# EasyEDA Pro project 四轮车板子.epro, board PCB6
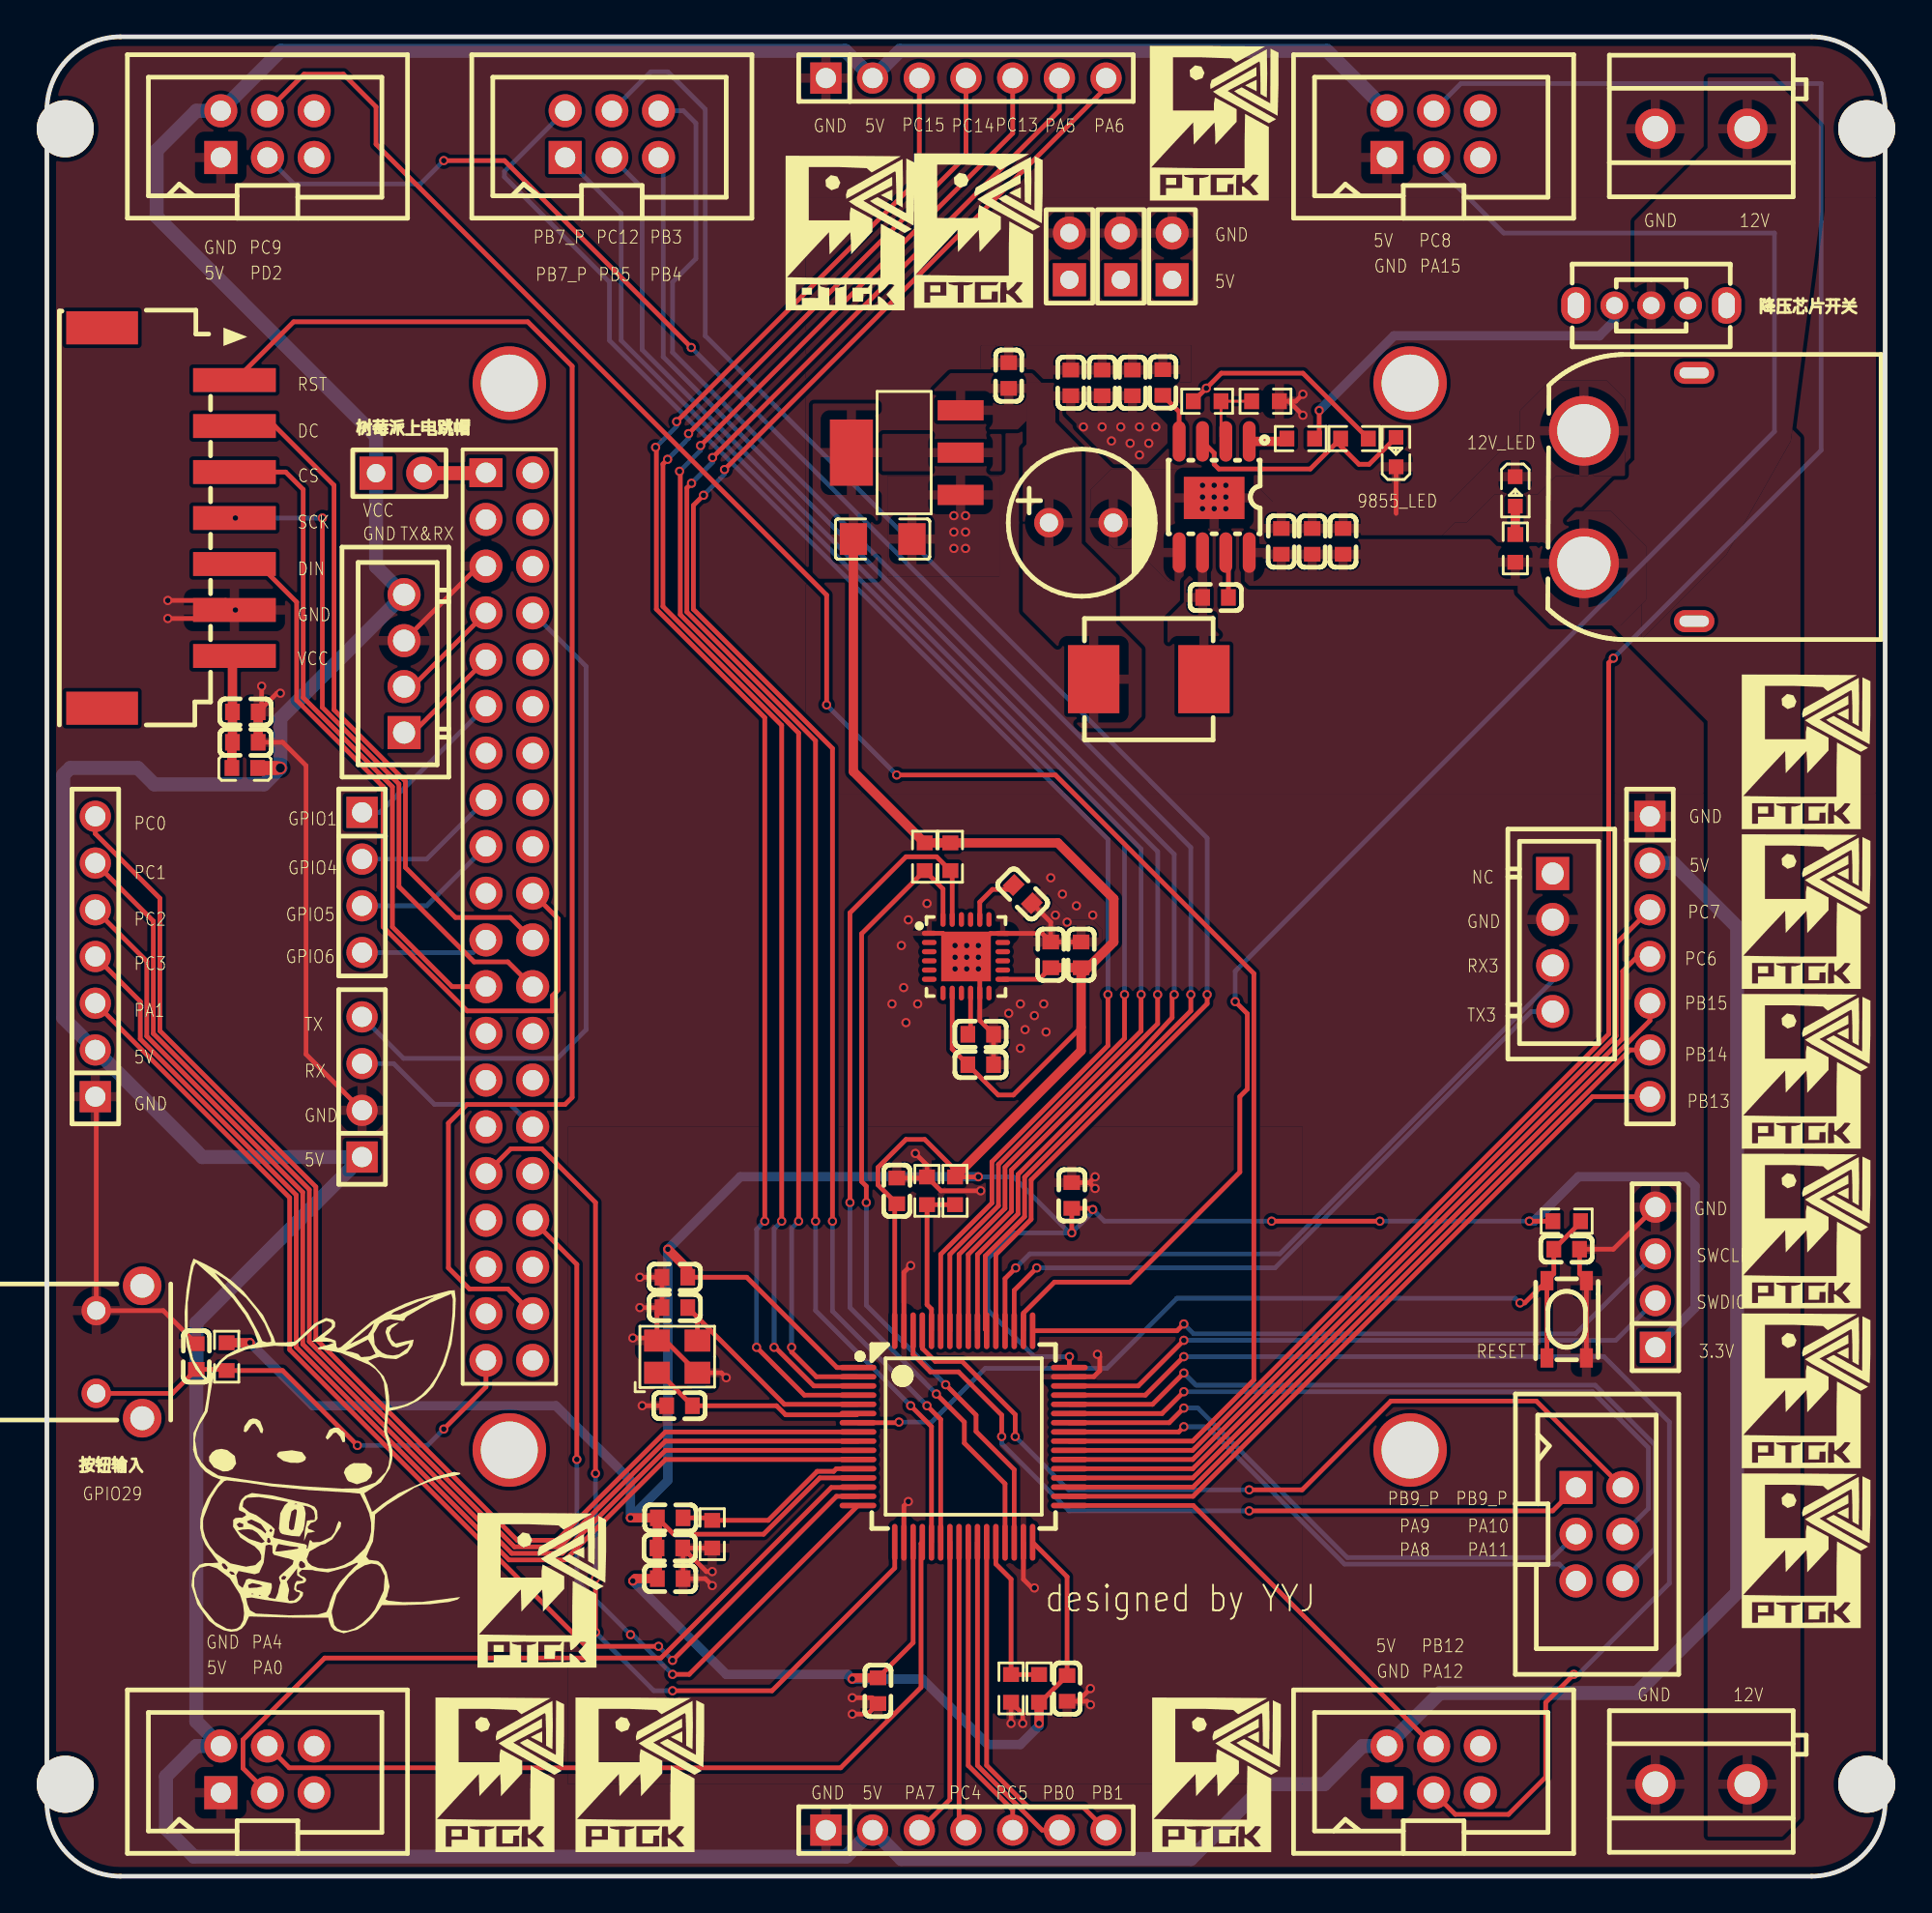
[diagram p12: board, top side]
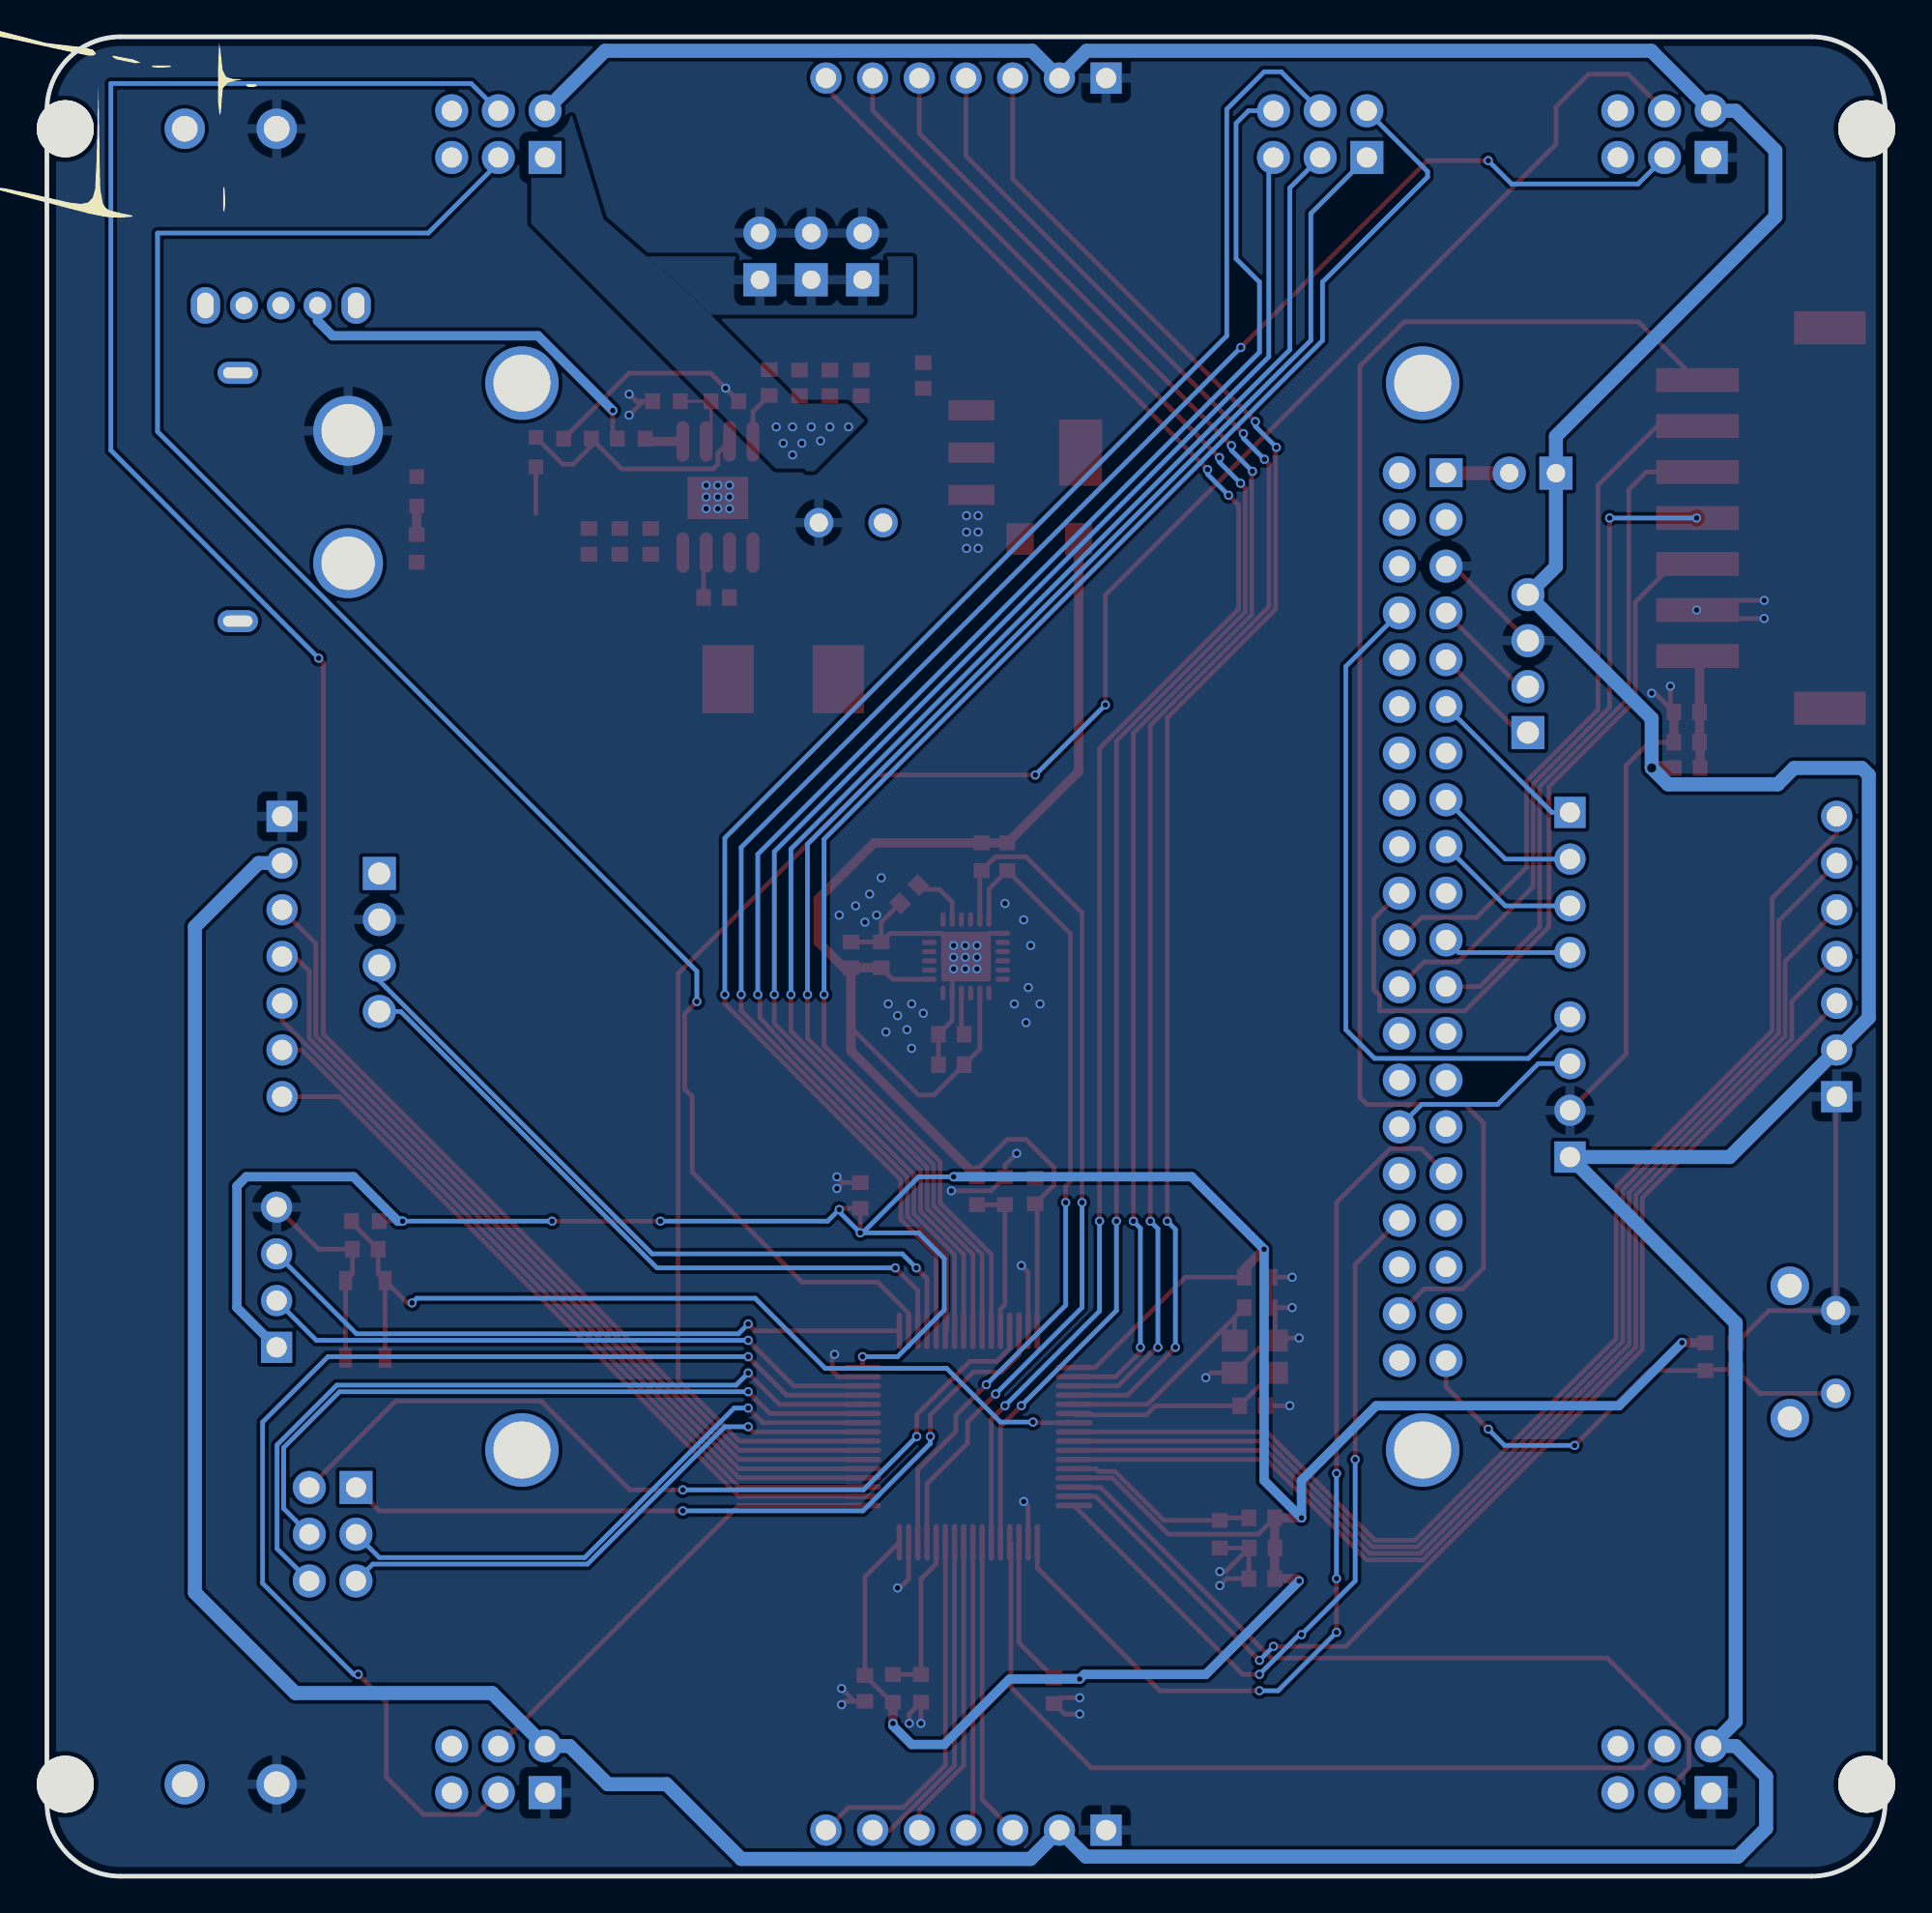
[diagram p13: board, bottom side, seen from below]

Outline 100 x 100 mm; copper layers: Top Layer, Bottom Layer. Coordinates in mm from the lower left corner of the outline.
Outline path: 0,96 0,4 arc(1.17,1.17) 4,0 96,0 arc(98.83,1.17) 100,4 100,96 arc(98.83,98.83) 96,100 4,100 arc(1.17,98.83) 0,96
Stack: Top Layer 0.035mm / Dielectric1 1.51mm FR4 er 4.5 / Bottom Layer 0.035mm

## Design rules (mm)
template: 自定义配置
spacing copperThickness1oz (default): track to track 0.102, other pairs 0.152 to 0.3
spacing copperThickness2oz: track to track 0.203, other pairs 0.152 to 0.3
track width copperThickness1oz (default): min 0.127, default 0.254, max 2.54
track width copperThickness2oz: min 0.203, default 0.254, max 2.54
differential pair differentialPair (default): width min 0.127, default 0.254, max 2.54; gap min 0.152, default 0.152
via viaSize (default): diameter min 0.5, default 0.61, max 10; hole min 0.3, default 0.305, max 6.3

## Placement (name value [footprint] x y rotation side)
C7  0.1u  [C0603]  8.13 28.25 270 top
C9  100nF  [C0603]  60.71 81.2 270 top
C10  22uF  [C0603]  67.15 72.57 90 top
C11  22uF  [C0603]  68.83 72.57 90 top
C12  100nF  [C0603]  70.51 72.57 90 top
C13  100nF  [C0603]  63.57 69.52 180 top
C15  22uF  [C0603]  55.7 81.19 270 top
C16  22uF  [C0603]  57.4 81.19 270 top
C17  0.1uF  [C0603]  59.06 81.19 270 top
C18  100nF  [C1206]  45.47 72.69 0 top
C19  100nF  [C0603]  52.32 81.58 90 top
C27  220uF  [CAP-TH_BD8.0-P3.50-D0.6-FD]  56.26 73.58 0 top
C29  100n  [C0603]  10.8 63.3 180 top
C30  10u  [C0603]  10.8 61.65 180 top
C31  100nF  [C0603]  50.8 44.12 0 top
C32  100nF  [C0603]  50.8 45.77 0 top
C33  2.2uF  [C0603]  53.09 53.39 315 top
C34  2.2uF  [C0603]  54.61 50.09 270 top
C35  100nF  [C0603]  56.26 50.09 270 top
C43  0.1u  [C0603]  34.16 32.56 0 top
C44  0.1u  [C0603]  45.21 10.08 90 top
C45  0.1u  [C0603]  55.75 37.01 270 top
C46  0.1u  [C0603]  46.24 37.26 270 top
C47  0.1u  [C0603]  55.5 10.21 90 top
C51  0.1u  [C0603]  82.68 34.09 0 top
C52  10p  [C0603]  34.16 30.91 0 top
C53  10p  [C0603]  34.42 25.58 0 top
C56  0.1u  [C0603]  33.91 19.48 180 top
C57  100nF  [C0603]  33.91 16.18 0 top
C58  10u  [C0603]  33.89 17.85 0 top
CN1  X8821WRS-07-9TSN  [CONN-SMD_X8821WRS-07-9TSN]  6.6 73.84 270 top
CN2  XT60PW-M  [CONN-TH_XT60PW-M]  86.61 74.98 180 top
CN3  XH-4A  [CONN-TH_4P-P2.50_XH-4A]  19.43 65.92 90 top
CN4  BH254V-6P  [IDC-TH_6P-P2.54-V-R2-C3-S2.54]  12 94.71 0 top
CN5  BH254V-6P  [IDC-TH_6P-P2.54-V-R2-C3-S2.54]  12 5.81 0 top
CN6  BH254V-6P  [IDC-TH_6P-P2.54-V-R2-C3-S2.54]  75.44 94.71 0 top
CN7  BH254V-6P  [IDC-TH_6P-P2.54-V-R2-C3-S2.54]  75.44 5.81 0 top
CN8  XH-4A  [CONN-TH_4P-P2.50_XH-4A]  81.91 50.76 270 top
CN9  BH254V-6P  [IDC-TH_6P-P2.54-V-R2-C3-S2.54]  30.73 94.71 0 top
CN10  BH254V-6P  [IDC-TH_6P-P2.54-V-R2-C3-S2.54]  84.46 18.59 270 top
H1  -  [HDR-TH_2P-P2.54-V-M-1]  55.63 88.06 90 top
H2  -  [HDR-TH_2P-P2.54-V-M-1]  58.42 88.06 90 top
H3  -  [HDR-TH_2P-P2.54-V-M-1]  61.21 88.06 90 top
H7  2.54mm2*20P直排针  [HDR-TH_40P-P2.54-V-M-R2-C20-S2.54]  25.16 52.17 270 top
H24  -  [HDR-TH_7P-P2.54-V-M]  50 97.76 0 top
H25  -  [HDR-TH_7P-P2.54-V-M]  2.64 50 90 top
H26  -  [HDR-TH_7P-P2.54-V-M]  87.21 50 270 top
H27  -  [HDR-TH_7P-P2.54-V-M]  50 2.51 0 top
H28  -  [HDR-TH_2P-P2.54-V-M-1]  19.18 76.28 0 top
H29  -  [HDR-TH_4P-P2.54-V-M]  87.5 32.56 90 top
H30  -  [HDR-TH_4P-P2.54-V-M]  17.14 54.03 270 top
L1  3.3uH  [IND-SMD_L7.0-W6.6]  59.94 65.08 180 top
L4  600Ω  [L0603]  10.77 60.25 180 top
LED1  -  [LED_0603]  73.39 77.47 90 top
LED4  -  [LED_0603]  79.89 75.23 270 top
NOREF  -  [Pad_e8]  74.16 23.17 270 top
NOREF#2  -  [Pad_e5]  25.16 81.17 270 top
NOREF#3  -  [Pad_e6]  74.16 81.17 180 top
NOREF#4  -  [Pad_e246]  99 95 0 top
NOREF#5  -  [Pad_e243]  1 95 0 top
NOREF#6  -  [Pad_e245]  99 5 0 top
NOREF#7  -  [Pad_e7]  25.16 23.17 90 top
NOREF#8  -  [Pad_e244]  1 5 0 top
R7  100K  [R0603]  68.21 78.16 180 top
R8  118K  [R0603]  63.12 80.19 180 top
R9  20.5K  [R0603]  66.29 80.19 180 top
R10  4.7K  [R0603]  71.13 78.16 180 top
R11  4.7K  [R0603]  49.15 55.42 90 top
R12  0  [R0603]  36.19 18.59 270 top
R22  10k  [R0603]  9.78 28.25 90 top
R23  4.7K  [R0603]  47.75 55.42 90 top
R24  10K  [R0603]  79.88 72.19 90 top
R52  10k  [R0603]  82.68 35.61 0 top
R57  NC  [R0603]  49.4 37.26 90 top
R58  NC  [R0603]  53.97 10.21 270 top
R59  10k  [R0603]  47.88 37.26 270 top
R60  10k  [R0603]  52.45 10.21 90 top
SW9  KAN0637-0701B  [SW-TH_KAN0637-0701B]  3.94 28.5 270 top
SW11  SS12D07L3B  [SW-TH_SS-12D07-X-X]  87.28 85.39 180 top
SW12  -  [SW-SMD_4P-L4.2-W3.4-P2.15-LS4.5-TL]  82.68 30.28 270 top
U3  STM32F103RCT6  [LQFP-64_L10.0-W10.0-P0.50-LS12.0-BL]  49.87 23.9 270 top
U5  FR9855SP  [SOIC-8_L4.9-W3.9-P1.27-LS6.0-BL-EP3.3]  63.5 74.98 180 top
U6  -  [SOT-223-3_L6.5-W3.4-P2.30-LS7.0-BR]  46.74 77.39 0 top
U10  MPU-6050  [QFN-24_L4.0-W4.0-P0.50-BL-EP2.7]  50 50.01 270 top
U12  KF301-5.0-2P  [CONN-TH_P5.00_KF301-5.0-2P]  90 95 0 top
U14  KF301-5.0-2P  [CONN-TH_P5.00_KF301-5.0-2P]  90 5 0 top
UART1  -  [HDR-TH_4P-P2.54-V-F]  17.14 42.91 90 top
X2  8MHz  [OSC-SMD_4P-L3.2-W2.5-BL]  34.29 28.25 0 top

## Footprints (pads in the part's own frame, mm; a bottom-side part is the same pattern mirrored in y, then rotated)
C0603
  rect 0.8x0.9 smd: 1(-0.7,0) 2(0.7,0)
C1206
  rect 1.485x1.728 smd: 1(-1.593,0) 2(1.593,0)
CAP-TH_BD8.0-P3.50-D0.6-FD
  round 1.6 hole 1: 1(-1.75,0) 2(1.75,0)
CONN-SMD_X8821WRS-07-9TSN
  rect 1.3x4.5 smd: 1(-7.5,3.6) 2(-5,3.6) 3(-2.5,3.6) 4(0,3.6) 5(2.5,3.6) 6(5,3.6) 7(7.5,3.6)
  rect 1.8x3.9 smd: 8(10.34,-3.6) 9(-10.34,-3.6)
CONN-TH_4P-P2.50_XH-4A
  rect 1.8x1.8 hole 1.199: 1(-3.751,0)
  round 1.8 hole 1.199: 2(-1.25,0) 3(1.25,0) 4(3.751,0)
CONN-TH_P5.00_KF301-5.0-2P
  round 2.2 hole 1.4: 1(-2.5,0) 2(2.5,0)
CONN-TH_XT60PW-M
  round 3.8 hole 2.9: 1(3,-3.6) 2(3,3.6)
  oval 2.2x1.2 hole 1.6x0.6: 3(-3,6.75) 4(-3,-6.75)
HDR-TH_2P-P2.54-V-M-1
  rect 1.8x1.8 hole 1: 1(-1.27,0)
  round 1.8 hole 1: 2(1.27,0)
HDR-TH_4P-P2.54-V-F
  rect 1.7x1.7 hole 1.1: 1(-3.81,0)
  round 1.7 hole 1.1: 2(-1.27,0) 3(1.27,0) 4(3.81,0)
HDR-TH_4P-P2.54-V-M
  rect 1.7x1.7 hole 1.1: 1(-3.81,0)
  round 1.7 hole 1.1: 2(-1.27,0) 3(1.27,0) 4(3.81,0)
HDR-TH_7P-P2.54-V-M
  rect 1.7x1.7 hole 1.1: 1(-7.62,0)
  round 1.7 hole 1.1: 2(-5.08,0) 3(-2.54,0) 4(0,0) 5(2.54,0) 6(5.08,0) 7(7.62,0)
HDR-TH_40P-P2.54-V-M-R2-C20-S2.54
  rect 1.575x1.8 hole 1.1: 1(-24.13,-1.27)
  round 1.8 hole 1.1: 2(-24.13,1.27) 3(-21.59,-1.27) 4(-21.59,1.27) 5(-19.05,-1.27) 6(-19.05,1.27) 7(-16.51,-1.27) 8(-16.51,1.27) 9(-13.97,-1.27) 10(-13.97,1.27) 11(-11.43,-1.27) 12(-11.43,1.27) 13(-8.89,-1.27) 14(-8.89,1.27) 15(-6.35,-1.27) 16(-6.35,1.27) 17(-3.81,-1.27) 18(-3.81,1.27) 19(-1.27,-1.27) 20(-1.27,1.27) 21(1.27,-1.27) 22(1.27,1.27) 23(3.81,-1.27) 24(3.81,1.27) 25(6.35,-1.27) 26(6.35,1.27) 27(8.89,-1.27) 28(8.89,1.27) 29(11.43,-1.27) 30(11.43,1.27) 31(13.97,-1.27) 32(13.97,1.27) 33(16.51,-1.27) 34(16.51,1.27) 35(19.05,-1.27) 36(19.05,1.27) 37(21.59,-1.27) 38(21.59,1.27) 39(24.13,-1.27) 40(24.13,1.27)
IDC-TH_6P-P2.54-V-R2-C3-S2.54
  rect 1.8x1.8 hole 1.1: 1(-2.54,-1.27)
  round 1.8 hole 1.1: 2(-2.54,1.27) 3(0,-1.27) 4(0,1.27) 5(2.54,-1.27) 6(2.54,1.27)
IND-SMD_L7.0-W6.6
  rect 2.799x3.701 smd: 1(-2.999,0) 2(2.999,0)
L0603
  rect 0.8x0.864 smd: 1(-0.7,0) 2(0.7,0)
LED_0603
  rect 0.8x0.8 smd: 1(-0.851,-0.01) 2(0.75,-0.005)
LQFP-64_L10.0-W10.0-P0.50-LS12.0-BL
  oval 0.3x2 smd: 1(-3.75,-5.75) 2(-3.249,-5.75) 3(-2.75,-5.75) 4(-2.249,-5.75) 5(-1.75,-5.75) 6(-1.25,-5.75) 7(-0.75,-5.75) 8(-0.249,-5.75) 9(0.25,-5.75) 10(0.75,-5.75) 11(1.25,-5.75) 12(1.75,-5.75) 13(2.25,-5.75) 14(2.751,-5.75) 15(3.25,-5.75) 16(3.751,-5.75) 33(3.751,5.75) 34(3.25,5.75) 35(2.751,5.75) 36(2.25,5.75) 37(1.75,5.75) 38(1.25,5.75) 39(0.75,5.75) 40(0.25,5.75) 41(-0.249,5.75) 42(-0.75,5.75) 43(-1.25,5.75) 44(-1.75,5.75) 45(-2.249,5.75) 46(-2.75,5.75) 47(-3.249,5.75) 48(-3.75,5.75)
  oval 2x0.3 smd: 17(5.75,-3.75) 18(5.75,-3.25) 19(5.75,-2.75) 20(5.75,-2.25) 21(5.75,-1.75) 22(5.75,-1.25) 23(5.75,-0.75) 24(5.75,-0.25) 25(5.75,0.25) 26(5.75,0.75) 27(5.75,1.25) 28(5.75,1.75) 29(5.75,2.25) 30(5.75,2.75) 31(5.75,3.25) 32(5.75,3.75) 49(-5.75,3.75) 50(-5.75,3.25) 51(-5.75,2.75) 52(-5.75,2.25) 53(-5.75,1.75) 54(-5.75,1.25) 55(-5.75,0.75) 56(-5.75,0.25) 57(-5.75,-0.25) 58(-5.75,-0.75) 59(-5.75,-1.25) 60(-5.75,-1.75) 61(-5.75,-2.25) 62(-5.75,-2.75) 63(-5.75,-3.25) 64(-5.75,-3.75)
OSC-SMD_4P-L3.2-W2.5-BL
  rect 1.4x1.2 smd: 1(-1.1,-0.875) 2(1.1,-0.875) 3(1.1,0.875) 4(-1.1,0.875)
Pad_e5
  round 4 hole 3.1: 1(0,0)
Pad_e6
  round 4 hole 3.1: 1(0,0)
Pad_e7
  round 4 hole 3.1: 1(0,0)
Pad_e8
  round 4 hole 3.1: 1(0,0)
Pad_e243
  round 3.1 hole 3.1: 1(0,0)
Pad_e244
  round 3.1 hole 3.1: 1(0,0)
Pad_e245
  round 3.1 hole 3.1: 1(0,0)
Pad_e246
  round 3.1 hole 3.1: 1(0,0)
QFN-24_L4.0-W4.0-P0.50-BL-EP2.7
  oval 0.28x0.8 smd: 1(-1.25,-2) 2(-0.75,-2) 3(-0.25,-2) 4(0.25,-2) 5(0.75,-2) 6(1.25,-2) 13(1.25,2) 14(0.75,2) 15(0.25,2) 16(-0.25,2) 17(-0.75,2) 18(-1.242,2)
  oval 0.8x0.28 smd: 7(2,-1.25) 8(2,-0.75) 9(2,-0.25) 10(2,0.25) 11(2,0.75) 12(2,1.25) 19(-2,1.25) 20(-2,0.75) 21(-2,0.25) 22(-2,-0.25) 23(-2,-0.75) 24(-2,-1.25)
  rect 2.7x2.7 smd: 25(0.013,0)
R0603
  rect 0.806x0.864 smd: 1(-0.753,0) 2(0.753,0)
SOIC-8_L4.9-W3.9-P1.27-LS6.0-BL-EP3.3
  oval 0.7x2.2 smd: 1(-1.905,-3.022) 2(-0.635,-3.022) 3(0.635,-3.022) 4(1.905,-3.022) 5(1.905,3.022) 6(0.635,3.022) 7(-0.635,3.022) 8(-1.905,3.022)
  rect 3.3x2.3 smd: 9(0,0.051)
SOT-223-3_L6.5-W3.4-P2.30-LS7.0-BR
  rect 2.5x1.1 smd: 1(2.97,-2.3) 2(2.97,0) 3(2.97,2.3)
  rect 2.34x3.6 smd: 4(-2.97,0)
SW-SMD_4P-L4.2-W3.4-P2.15-LS4.5-TL
  rect 1.049x0.701 smd: 1(-2.1,1.075) 2(2.1,1.075) 3(-2.1,-1.075) 4(2.1,-1.075)
SW-TH_KAN0637-0701B
  round 1.6 hole 1: 1(-2.25,-1.25) 2(2.25,-1.25)
  round 2.1 hole 1.3: 3(-3.6,1.25) 4(3.6,1.25)
SW-TH_SS-12D07-X-X
  round 1.524 hole 0.914: 1(-2,0) 2(0,0) 3(2,0)
  oval 1.6x2 hole 0.9x1.4: EH(-4.1,0) EH(4.1,0)

## Nets
As in the schematic.

Pads without a net: CN1 8 9; CN2 3 4; CN4 5 6; CN5 5 6; CN6 5 6; CN7 5 6; CN8 1; H7 2 3 4 6 10 12 13 14 16 18 19 25 26 27 28 29 32 33 35 36 37 40; NOREF 1; NOREF#2 1; NOREF#3 1; NOREF#4 1; NOREF#5 1; NOREF#6 1; NOREF#7 1; NOREF#8 1; SW9 3 4; SW11 1 EH; U10 2 3 4 5 6 7 9 12 14 15 16 17 19 21 22

## Via types
v1: diameter 0.5, hole 0.3, Top Layer to Bottom Layer, 162 vias
v2: diameter 0.7, hole 0.5, Top Layer to Bottom Layer, 1 via

## Routing (per net, layer and track width the routed paths; a pad name or vN(x,y) marks a point on that pad's centre or on a via; arc(x,y) is an arc through that point)
AGND: length 10.7
  Top Layer w0.254: U3.12 42.95,22.15 42.8,22.01 41.9,22.01 39.24,19.35 R12.1 36.06,19.48 C56.1
GND: length 139.7
  Top Layer w0.254: 46.24,37.96 47.82,37.96 R59.1 ; 56.7,37.71 56.71,37.71 v1(57.02,38.02) ; 56.7,37.71 v1(57.02,37.39) ; 56.7,37.71 C45.1 ; v1(46.99,33.2) 46.62,32.83 U3.63 ; v1(47.24,39.29) 47.88,38.66 R59.1 ; C52.1 33.19,30.64 X2.4 ; C52.1 v1(32.26,30.91) ; C52.1 C43.1 v1(32.26,32.56) ; v1(12.7,64.31) 12.51,64.31 11.68,63.49 ; U3.47 56.95,27.15 57.28,27.48 57.28,28.25 v1(57.15,28.37) ; v1(43.81,9.7) 44.89,9.7 C44.1 44.64,8.81 v1(43.81,8.81) ; CN3.3 23.48,71.22 H7.5 ; v1(36.96,27.1) 36.69,27.37 X2.2 33.64,29.12 X2.4 ; C47.1 56.08,9.51 ; 56.08,9.51 v1(56.77,10.2) ; 56.08,9.51 56.58,9.51 v1(56.77,9.32) ; UART1.2 14.1,44.68 14.1,60.38 12.83,61.65 C30.1 ; v1(36.19,15.8) 35.81,16.18 C57.2 34.61,17.83 ; v1(50.67,49.33) 50.75,49.25 U10.11 50.75,46.52 C32.2 C31.2 ; 34.61,17.83 35.88,16.56 v1(36.19,16.56) ; 34.61,17.83 34.6,17.84 ; 67.56,80.19 67.94,80.19 v1(68.33,80.57) ; 67.56,80.19 R9.1 ; 67.56,80.19 v1(68.33,79.43) ; U3.18 46.62,20.13 v1(46.86,20.37) ; v1(32.39,25.58) 32.39,25.58 C53.1 ; R59.1 48.63,37.26 v1(50.8,37.26) ; v1(53.72,15.67) 53.59,15.67 53.12,16.14 U3.31 ; v1(52.45,8.31) R60.1 53.09,8.82 v1(53.09,8.31) ; SW12.2 SW12.1 83.38,32.75 C51.2 85.22,34.09 H29.4 ; v1(31.88,29.26) 33.05,29.26 X2.4 ; U10.25 v1(50.04,49.96) ; v1(6.58,68.38) 9.79,68.38 v1(10.25,68.84) 9.73,69.36 v1(6.58,69.36) ; v1(50.67,50.6) 51.33,51.25 U10.18 54.14,51.25 C34.1 ; C7.1 6.33,30.75 SW9.1 2.69,42.33 H25.1 ; C29.1 11.68,63.49 ; 11.68,63.49 v1(11.68,64.69) ; C33.2 54.61,51.87 C34.1 ; v1(49.4,50.6) 48.74,51.26 U10.1 ; C34.1 C35.1 ; 34.59,17.85 34.6,17.84 ; 34.6,17.84 R12.2 ; LED1.1 73.4,74.09
  Top Layer w0.508: C30.1 C29.1
  vias: v1(45.97,47.42) v1(46.48,50.6) v1(46.61,48.31) v1(46.74,46.41) v1(46.86,51.99) v1(47.37,47.42) v1(47.88,52.88) v1(49.34,73.97) v1(49.34,73.08) v1(49.34,72.19) v1(49.4,49.96) v1(49.4,49.33) v1(49.97,73.97) v1(49.97,73.08) v1(49.97,72.19) v1(50.04,50.6) v1(50.04,49.33) v1(50.67,49.96) v1(52.32,46.91) v1(52.96,47.42) v1(52.96,45.01) v1(53.21,46.03) v1(53.72,46.79) v1(54.23,47.42) v1(54.36,45.9) v1(54.61,54.28) v1(54.86,52.25) v1(55.25,53.39) v1(55.5,51.87) v1(56.01,52.76) v1(56.9,52.25) v1(62.87,75.62) v1(62.87,74.98) v1(62.87,74.35) v1(63.5,75.62) v1(63.5,74.98) v1(63.5,74.35) v1(64.13,75.62) v1(64.13,74.98) v1(64.13,74.35)
VCC_3.3V: length 292.2
  Top Layer w0.254: U3.64 46.12,36.44 C46.2 45.21,37.58 45.21,38.53 46.74,40.06 47.75,40.06 49.4,38.41 ; U3.48 55.62,28.24 v1(55.63,28.25) ; v1(56.9,36.25) 56.83,36.31 C45.2 v1(55.75,34.98) ; R52.1 v1(80.65,35.61) ; 56.26,46.15 52.58,42.47 51.75,42.47 C31.1 49.25,44.97 U10.8 ; U3.32 55.5,16.28 C47.2 54.05,9.46 R58.2 ; U3.19 47.12,12.69 C44.2 ; C43.2 38.07,32.56 42.98,27.65 U3.1 ; R57.2 50.66,38.02 v1(50.67,38.02) ; v1(66.63,35.61) v1(72.51,35.61) ; U3.13 42.05,21.65 38.99,18.59 34.1,18.59 C56.2 ; C34.2 53.98,48.76 U10.13
  Top Layer w0.508: C35.2 56.45,49.2 58.04,50.79 58.04,53.14 55,56.18 R11.2 R23.2 43.87,60.06 C18.1 ; C35.2 C34.2 ; C35.2 56.26,44.87 R57.2 49.4,38.41 ; v1(33.78,34.09) 34.86,33.01 C43.2 ; C44.2 43.88,10.78 v1(43.81,10.72) ; R58.2 v1(53.97,8.31) ; v1(11.05,29.01) 11.04,29 R22.2 ; v1(31.88,16.05) 32,16.18 C57.1 33.21,17.83 C58.1 33.21,17.87 C56.2 v1(31.75,19.48)
  Bottom Layer w0.254: v1(80.65,35.61) v1(72.51,35.61) ; v1(50.67,38.02) 52.58,38.02 55.5,35.1 ; v1(55.63,28.25) 53.72,28.25 51.18,30.78 51.18,33.58 52.58,34.98 v1(55.75,34.98) 56.9,36.12 v1(56.9,36.25) 57.53,35.61 v1(66.63,35.61)
  Bottom Layer w0.508: H29.1 89.66,30.91 89.66,37.52 89.15,38.02 83.31,38.02 80.9,35.61 v1(80.65,35.61) ; v1(50.67,38.02) 37.72,38.02 v1(33.78,34.09) 33.78,21.51 v1(31.75,19.48) 31.75,21.51 27.69,25.58 14.48,25.58 v1(11.05,29.01) ; v1(53.97,8.31) 53.97,8.18 52.96,7.16 51.18,7.16 47.62,10.72 v1(43.81,10.72) 43.56,10.97 36.96,10.97 v1(31.88,16.05)
VCC_5V: length 350.2
  Top Layer w0.254: R10.1 68.33,81.71 63.89,81.71 v1(63.07,80.9) R8.2
  Top Layer w0.762: L4.1 12.52,60.25
  Bottom Layer w0.762: H26.2 88.48,55.08 91.95,51.61 91.95,15.42 86.49,9.96 75.78,9.96 CN7.2 71.57,7.08 69.49,5 66.29,5 62.23,0.94 46.49,0.94 H27.2 43.48,1.07 8,1.07 6.48,2.59 6.48,5.43 8.13,7.08 CN5.2 8.13,8.41 8.13,30.08 UART1.1 8.46,39.1 H25.2 0.89,46.67 0.89,59.87 1.27,60.25 4.95,60.25 5.84,59.36 11.81,59.36 v2(12.7,60.25) 12.7,62.94 CN3.4 17.91,71.2 H28.1 17.91,78.28 5.97,90.22 5.97,93.82 8.13,95.98 CN4.2 12.72,99.24 43.44,99.24 H24.2 46.4,99.24 69.64,99.24 CN6.2
  vias: v1(56.39,78.79) v1(57.4,78.79) v1(57.91,78.03) v1(58.42,78.79) v1(58.93,77.9) v1(59.44,78.79) v1(59.44,77.27) v1(59.94,77.9) v1(60.32,78.79)
BOOT0: length 8.5
  Top Layer w0.254: R57.1 R59.2 47.88,31.08 48.12,30.83 U3.60
BOOT1: length 9.1
  Top Layer w0.254: U3.28 51.62,16.98 52.45,16.15 R60.2 R58.1
D0_LCD_DC: length 37.6
  Top Layer w0.254: 26.43,50.9 25.21,52.12 22.22,52.12 19.51,54.84 19.51,59.52 15.62,63.41 15.62,75.62 12.4,78.84 10.25,78.84
D1_LCD_RST: length 81.2
  Top Layer w0.254: 26.43,30.58 25.08,31.93 22.99,31.93 21.84,33.07 21.84,40.94 22.85,41.95 28.19,41.95 28.57,42.34 28.57,82.09 26.16,84.51 13.42,84.51 10.25,81.34
D5_LCD_SCK: length 36
  Top Layer w0.254: 26.43,48.36 25.08,49.71 23.24,49.71 19.15,53.8 19.15,59.38 14.99,63.54 v1(14.99,73.84)
  Bottom Layer w0.254: v1(10.25,73.84) v1(14.99,73.84)
D7_LCD_DIN: length 42.3
  Top Layer w0.254: 26.43,53.44 27.81,52.06 27.81,48.18 27.5,47.87 27.5,47.04 22.86,47.04 18.29,51.61 18.29,59.23 13.59,63.93 13.59,69.27 11.18,71.68 10.6,71.68 10.25,71.34
D8_LCD_CS: length 36.3
  Top Layer w0.254: H7.23 22.04,48.36 18.8,51.61 18.8,59.23 13.94,64.08 13.94,75.39 12.99,76.34 10.25,76.34
FR_BST: length 2.5
  Top Layer w0.254: U5.7 64.28,71.82 64.28,69.52
FR_FB: length 4
  Top Layer w0.152: R9.2 R8.1 63.87,78.27 U5.2
FR_PG: length 13.6
  Top Layer w0.254: LED1.2 71.93,76.76 71.37,76.76 70.38,77.75 R10.2 68.73,76.5 63.75,76.5 63.5,76.76 63.5,77.37 U5.3
GPIO29_KEY: length 26.2
  Top Layer w0.254: v1(21.59,24.31) 23.89,26.6 H7.39 ; v1(16.89,23.42) 12.82,27.49 R22.1 9.72,27.55 C7.2 6.83,26.25 SW9.2
  Bottom Layer w0.254: v1(16.89,23.42) 20.7,23.42 v1(21.59,24.31)
OS_8M_IN: length 12.7
  Top Layer w0.254: X2.3 35.39,30.38 ; 35.39,30.38 C52.2 ; 35.39,30.38 40.12,25.65 U3.5
OS_8M_OUT: length 11.9
  Top Layer w0.254: X2.1 33.32,27.37 C53.2 39.69,25.58 40.19,25.08 44.05,25.08 U3.6
PA0_IN0: length 42.6
  Top Layer w0.254: U3.14 44.1,21.13 42.67,21.13 33.4,11.86 15.11,11.86 10.67,7.42 10.67,5.87 CN5.3
PA1_BACKUP4: length 64.8
  Top Layer w0.254: H25.3 13.21,36.89 13.21,28.63 29.34,12.5 v1(33.27,12.5) ; v1(34.04,11.74) 42.96,20.65 U3.15
  Bottom Layer w0.254: v1(34.04,11.74) v1(33.27,12.5)
PA2_UART2_TX: length 41.8
  Top Layer w0.254: U3.16 34.94,10.97 v1(34.04,10.97) ; v1(28.83,22.66) 28.83,33.26 26.43,35.66
  Bottom Layer w0.254: v1(28.83,22.66) 28.83,16.05 v1(31.75,13.13) 31.88,13.13 v1(34.04,10.97)
PA3_UART2_RX: length 52.8
  Top Layer w0.254: v1(29.84,21.9) 29.84,36.63 26.92,39.55 25.23,39.55 23.89,38.2 ; U3.17 46.12,16.76 39.45,10.08 v1(34.04,10.08) ; v1(29.84,16.18) v1(29.84,13.26)
  Bottom Layer w0.254: v1(29.84,21.9) v1(29.84,16.18) ; v1(34.04,10.08) 33.02,10.08 v1(29.84,13.26)
PA4_INPUT16: length 45.8
  Top Layer w0.254: U3.20 47.55,18.08 47.55,10.26 43.18,5.89 13.19,5.89 CN5.4
PA5_INPUT17: length 93.5
  Top Layer w0.254: v1(41.81,35.61) 41.81,61.73 34.81,68.73 34.81,75.47 v1(35.07,75.73) ; v1(46.99,25.58) 48.12,24.44 U3.21 ; H24.6 55.08,95.99 v1(36.21,77.12)
  Bottom Layer w0.254: v1(36.21,77.12) 36.21,76.87 v1(35.07,75.73) ; v1(41.81,35.61) 41.81,30.75 v1(46.99,25.58)
PA6_INPUT18: length 94.5
  Top Layer w0.254: U3.22 48.62,24.83 v1(47.88,25.58) ; v1(35.72,75.08) 35.17,74.53 35.17,68.88 42.74,61.31 v1(42.74,35.61) ; H24.7 57.62,97.23 v1(36.86,76.47)
  Bottom Layer w0.254: v1(42.74,35.61) 42.74,30.72 v1(47.88,25.58) ; v1(36.86,76.47) 36.86,76.22 v1(35.72,75.08)
PA7_INPUT10: length 16.3
  Top Layer w0.254: U3.23 49.12,4.17 H27.3
PA8_AIN2_R: length 31.2
  Top Layer w0.254: v1(61.85,24.44) 61.57,24.15 U3.41
  Bottom Layer w0.254: CN10.5 82.27,16.97 70.59,16.97 63.12,24.44 v1(61.85,24.44)
PA9_AIN1_R: length 31.8
  Top Layer w0.254: v1(61.85,25.45) 61.05,24.65 U3.42
  Bottom Layer w0.254: v1(61.85,25.45) 62.61,25.45 70.74,17.32 81.91,17.32 CN10.3
PA10_BIN1_R: length 38.5
  Top Layer w0.254: U3.43 60.66,25.15 v1(61.85,26.34)
  Bottom Layer w0.254: v1(61.85,26.34) 84.08,26.34 87.12,23.3 87.12,19.99 85.72,18.59
PA11_BIN2_R: length 42.3
  Top Layer w0.254: U3.44 60.15,25.65 v1(61.85,27.36)
  Bottom Layer w0.254: 85.72,16.05 87.48,17.81 87.48,23.44 84.23,26.7 62.51,26.7 v1(61.85,27.36)
PA12_IN1: length 64.6
  Top Layer w0.254: U3.45 59.76,26.15 v1(61.85,28.25) ; CN7.3 76.62,3.36 79.51,3.36 81.53,5.38 81.53,9.44 v1(83.07,10.97)
  Bottom Layer w0.254: v1(83.07,10.97) 83.31,10.97 88.26,15.93 88.26,24.69 84.71,28.25 v1(61.85,28.25)
PA15_IN2: length 100
  Top Layer w0.254: U3.50 53.12,30.61 54.81,32.3 58.92,32.3 64.9,38.28 64.9,42.38 65.3,42.79 65.3,46.89 v1(64.64,47.55)
  Bottom Layer w0.254: v1(64.64,47.55) 64.64,49.2 93.98,78.54 93.98,89.33 79.25,89.33 75.44,93.14 CN6.3
PB0_INPUT14: length 18
  Top Layer w0.254: U3.26 50.62,6.02 54.14,2.51 H27.6
PB1_INPUT15: length 20.1
  Top Layer w0.254: U3.27 51.12,6.02 53.41,3.73 56.39,3.73 H27.7
PB3_AIN2_L: length 84.2
  Top Layer w0.254: v1(61.33,47.93) 61.21,47.82 61.21,46.68 59.51,44.83 52.83,38.15 52.83,36.01 50.62,33.8 U3.55
  Bottom Layer w0.254: CN9.6 34.63,95.98 35.31,95.3 35.31,87.94 34.04,86.67 34.04,82.85 61.33,55.56 v1(61.33,47.93)
PB4_BIN1_L: length 79.3
  Top Layer w0.254: U3.56 50.12,33.8 52.48,36.15 52.48,38.4 60.43,46.35 v1(60.43,47.93)
  Bottom Layer w0.254: v1(60.43,47.93) 60.43,55.7 33.53,82.6 33.53,93.18 CN9.5
PB5_BIN2_L: length 79.8
  Top Layer w0.254: v1(59.53,47.93) 59.53,45.95 52.12,38.55 52.12,36.3 49.62,33.8 U3.57
  Bottom Layer w0.254: CN9.3 32.38,91.79 32.38,82.98 59.53,55.84 v1(59.53,47.93)
PB6_PMMA_R: length 80.3
  Top Layer w0.254: U3.58 49.12,33.81 51.76,36.45 51.76,38.69 58.62,45.55 v1(58.62,47.93)
  Bottom Layer w0.254: CN9.1 31.24,90.39 31.24,83.49 58.62,56.11 v1(58.62,47.93)
PB7_PMMB_R: length 85.1
  Top Layer w0.254: v1(57.72,47.93) 57.72,45.15 51.41,38.84 51.41,36.6 48.62,33.81 U3.59
  Bottom Layer w0.254: CN9.2 24.89,92.68 24.89,92.38 30.61,86.67 30.61,83.49 57.72,56.38 v1(57.72,47.93)
PB8_PMMA_L: length 46.9
  Top Layer w0.254: v1(65.41,21.01) 68.29,21.01 73.11,25.83 81.03,25.83 85.72,21.13 ; U3.61 47.62,28.7 48.33,27.99 49.78,27.99 52.68,25.1 v1(52.68,23.9)
  Bottom Layer w0.254: v1(52.68,23.9) 55.58,21.01 v1(65.41,21.01)
PB9_PMMB_L: length 42.3
  Top Layer w0.254: v1(65.41,19.86) 81.91,19.86 CN10.1 ; U3.62 47.12,28.36 48.07,27.42 49.59,27.42 51.94,25.07 v1(51.94,23.9)
  Bottom Layer w0.254: v1(65.41,19.86) 55.6,19.86 51.94,23.53 v1(51.94,23.9)
PB10_SCL: length 47.4
  Top Layer w0.254: v1(48.39,26.21) 49.91,24.69 49.91,23.55 52.12,21.33 U3.29 ; v1(43.69,36.63) 43.69,52.38 46.74,55.42 48.4,55.42 R11.1 49.25,54.57 U10.23
  Bottom Layer w0.254: v1(43.69,36.63) 43.69,30.91 v1(48.39,26.21)
PB11_SDA: length 44.4
  Top Layer w0.254: v1(44.58,36.63) 44.58,37.51 44.32,37.77 44.32,51.24 R23.1 48.75,53.67 U10.24 ; v1(48.9,26.72) 50.55,25.07 50.55,24.18 52.62,22.1 U3.30
  Bottom Layer w0.254: v1(44.58,36.63) 44.58,31.04 v1(48.9,26.72)
PB12_BACKUP0: length 25.2
  Top Layer w0.254: CN7.4 62.36,20.15 U3.33
PB13_BACKUP1: length 40.6
  Top Layer w0.254: H26.7 84.08,42.38 62.35,20.65 U3.34
PB14_BACKUP2: length 41.4
  Top Layer w0.254: U3.35 62.35,21.15 86.12,44.92 H26.6
PB15_BACKUP3: length 42.8
  Top Layer w0.254: U3.36 62.34,21.65 87.21,46.52 H26.5
PC0_INPUT0: length 69.8
  Top Layer w0.254: H25.7 2.64,56.68 6.15,53.17 6.15,45.96 14.63,37.48 14.63,29.22 25.58,18.26 27.75,18.26 33.64,24.15 U3.8
PC1_INPUT1: length 67.7
  Top Layer w0.254: U3.9 33.65,23.65 27.9,17.91 25.44,17.91 14.28,29.07 14.28,37.33 5.79,45.81 5.79,51.92 H25.6
PC2_INPUT2: length 65.5
  Top Layer w0.254: U3.10 33.65,23.15 28.05,17.55 25.29,17.55 13.92,28.92 13.92,37.18 5.44,45.67 5.44,49.74 H25.5
PC3_INPUT3: length 63.4
  Top Layer w0.254: H25.4 5.08,47.56 5.08,45.52 13.56,37.03 13.56,28.77 25.14,17.2 28.19,17.2 33.65,22.65 U3.11
PC4_INPUT4: length 15.8
  Top Layer w0.254: H27.4 49.62,2.88 U3.24
PC5_INPUT5: length 16.6
  Top Layer w0.254: H27.5 52.54,3.6 50.12,6.02 U3.25
PC6_INPUT6: length 45.3
  Top Layer w0.254: H26.4 86.53,50 85.72,49.2 85.72,45.54 62.34,22.15 U3.37
PC7_INPUT7: length 46.9
  Top Layer w0.254: H26.3 85.37,50.7 85.37,45.69 62.34,22.65 U3.38
PC8_INPUT8: length 116.9
  Top Layer w0.254: U3.39 62.33,23.15 84.96,45.78 84.96,65.96 v1(85.22,66.22)
  Bottom Layer w0.254: v1(85.22,66.22) 96.52,77.52 96.52,97.46 76.92,97.46 CN6.4
PC9_INPUT9: length 112.9
  Top Layer w0.254: CN4.4 13.99,97.97 16.13,97.97 17.91,96.19 17.91,94.16 42.42,69.65 v1(42.42,63.68) ; v1(46.23,59.87) 54.86,59.87 65.66,49.07 65.66,26.98 62.33,23.65 U3.40
  Bottom Layer w0.254: v1(46.23,59.87) v1(42.42,63.68)
PC12_AIN1_L: length 89.3
  Top Layer w0.254: U3.53 51.62,33.79 53.54,35.71 53.54,37.86 63.12,47.43 v1(63.12,47.93)
  Bottom Layer w0.254: CN9.4 32.85,98.09 33.78,98.09 35.81,96.06 35.81,83.74 63.12,56.44 v1(63.12,47.93)
PC13_INPUT11: length 83.8
  Top Layer w0.254: U3.2 41.86,27.15 40.51,28.5 v1(40.51,28.75) ; v1(35.56,77.78) 52.54,94.75 H24.5 ; v1(34.42,76.38) 34.46,76.34 34.46,68.58 40.89,62.15 v1(40.89,35.61)
  Bottom Layer w0.254: v1(35.56,77.78) 35.56,77.52 v1(34.42,76.38) ; v1(40.89,35.61) 40.51,35.23 v1(40.51,28.75)
PC14_INPUT12: length 84.1
  Top Layer w0.254: v1(39.56,28.75) 39.62,28.75 41.72,26.65 U3.3 ; v1(39.97,35.61) 39.97,62.57 33.51,69.03 33.51,76.78 v1(33.77,77.03) ; v1(34.91,78.43) 50,93.52 H24.4
  Bottom Layer w0.254: v1(39.97,35.61) 39.56,35.2 v1(39.56,28.75) ; v1(33.77,77.03) 34.91,78.17 v1(34.91,78.43)
PC15_INPUT13: length 84.2
  Top Layer w0.254: H24.3 47.46,92.28 v1(34.26,79.08) ; U3.4 41.21,26.15 v1(38.61,28.75) ; v1(39.05,35.61) 39.05,62.98 33.16,68.88 33.16,77.64 v1(33.12,77.68)
  Bottom Layer w0.254: v1(38.61,28.75) 38.61,35.17 v1(39.05,35.61) ; v1(34.26,79.08) 34.26,78.82 v1(33.12,77.68)
PD2_IN3: length 97.8
  Top Layer w0.254: v1(35.05,83.11) 24.89,93.27 v1(21.59,93.27) ; U3.54 51.05,29.72 51.05,33.72 53.19,35.86 53.19,38 62.23,47.05 v1(62.23,47.93)
  Bottom Layer w0.254: v1(21.59,93.27) 20.32,92 13.44,92 CN4.3 ; v1(35.05,83.11) 62.23,55.93 v1(62.23,47.93)
RESET: length 49.1
  Top Layer w0.254: SW12.3 80.39,31.17 v1(80.14,31.17) ; SW12.3 SW12.4 ; SW12.3 81.98,32.75 C51.1 83.43,35.54 R52.2 ; v1(46.35,24.69) 46.32,24.65 U3.7
  Bottom Layer w0.254: v1(46.35,24.69) 48.13,24.69 51.05,27.61 57.66,27.61 61.47,31.42 79.88,31.42 v1(80.14,31.17)
RPI_GPIO1_BACKUP0: length 9.1
  Bottom Layer w0.254: H30.1 18.12,57.84 H7.11
RPI_GPIO4_BACKUP1: length 8.1
  Bottom Layer w0.254: H7.15 20.66,55.3 H30.2
RPI_GPIO5_BACKUP2: length 8.1
  Bottom Layer w0.254: H30.3 20.66,52.76 23.89,55.98
RPI_GPIO6_BACKUP3: length 7
  Bottom Layer w0.254: 23.89,50.9 23.2,50.22 H30.4
RPI_RX: length 10.7
  Bottom Layer w0.254: UART1.3 18.87,44.18 21.08,41.96 25.21,41.96 26.43,40.74
RPI_TX: length 37.6
  Bottom Layer w0.254: UART1.4 19.4,44.46 27.77,44.46 29.34,46.03 29.34,65.77 26.43,68.68
RX0: length 6.1
  Top Layer w0.254: H7.9 19.92,62.17 CN3.1
SWCLK: length 36.1
  Top Layer w0.254: U3.49 61.48,29.65 v1(61.85,30.02)
  Bottom Layer w0.254: v1(61.85,30.02) 62.38,29.49 83.16,29.49 H29.3
SWDIO: length 33.8
  Top Layer w0.254: U3.46 59.37,26.65 v1(61.85,29.13)
  Bottom Layer w0.254: v1(61.85,29.13) 85.34,29.13 H29.2
TX0: length 6.1
  Top Layer w0.254: 23.89,68.68 19.88,64.67 CN3.2
UART3_RX: length 40.2
  Top Layer w0.254: v1(52.71,33.07) 52.12,32.49 U3.52
  Bottom Layer w0.254: CN8.3 81.91,48.68 67.07,33.83 53.47,33.83 v1(52.71,33.07)
UART3_TX: length 37.8
  Top Layer w0.254: v1(53.85,33.07) 52.62,31.85 U3.51
  Bottom Layer w0.254: v1(53.85,33.07) 66.81,33.07 80.75,47.01 CN8.4
$2N1181: length 2.1
  Top Layer w0.508: R7.2 67.3,78 U5.1
$2N1291: length 2.9
  Top Layer w0.254: U5.4 61.59,79.61 C9.2
$2N18130: length 1.5
  Top Layer w0.508: R24.2 79.88,74.48 LED4.2
$2N20270: length 20.5
  Top Layer w0.254: v1(69.22,79.68) 69.22,78.41 R7.1
  Bottom Layer w0.508: SW11.3 85.28,84.56 84.46,83.74 73.28,83.74 v1(69.22,79.68)
$3N577: length 6.2
  Top Layer w0.508: 10.25,66.34 10.09,66.18 C29.2 C30.2 10.06,61.62 L4.2
$3N3144: length 3.5
  Top Layer w0.762: H7.1 23.86,76.28 H28.2
$4N1404: length 2.4
  Top Layer w0.254: C32.1 50.25,45.77 U10.10
$4N1517: length 3.2
  Top Layer w0.254: C33.1 52.35,53.64 51.44,53.64 50.75,52.96 U10.20

## Copper pours and planes (outline as drawn; the poured copper is in the pictures)
GND on Top Layer: 53.08,53.4 54.35,53.4 55.75,51.99 56.9,51.99 57.4,51.49 57.4,50.81 56.98,50.38 54.25,50.38 53.97,50.1 53.97,51.11 52.78,52.3 52.78,52.69 52.96,53.01
GND on Top Layer: 41.27,91.28 107.31,91.28 107.31,58.85 41.27,58.85
GND on Top Layer: 59.18,72.19 60.96,70.41 61.47,70.41 61.85,70.79 61.85,72.86 62.23,73.24 66.01,73.24 66.55,72.69 75.69,72.69 76.58,73.58 77.22,73.58 78.74,75.11 81.08,75.11 82.1,76.12 85.85,76.12 85.85,80.31 84.84,81.33 81.79,81.33 80.14,79.68 80.14,78.54 76.33,74.73 66.68,74.73 65.66,75.74 65.66,76.5 57.91,76.5 56.77,75.36 56.77,73.46 58.04,72.19
GND on Top Layer: -7.37,106.22 115.06,106.22 115.06,-9.98 -7.37,-9.98
GND on Top Layer: 45.72,76.12 51.82,76.12 51.82,70.66 45.72,70.66
GND on Top Layer: 28.35,40.74 68.32,40.74 68.32,5 28.35,5
GND on Top Layer: 50.8,83.24 62.26,83.24 62.26,81.21 50.8,81.21
GND on Bottom Layer: -13.97,112.32 121.28,112.32 121.28,-15.19 -13.97,-15.19
VCC_3.3V on Top Layer: 41.66,80.06 45.21,80.06 45.21,70.54 41.66,70.54
VCC_3.3V on Top Layer: 42.16,78.41 51.94,78.41 51.94,76.38 42.16,76.38
VCC_5V on Top Layer: 48.11,78.65 52.82,78.65 54.1,79.93 54.1,81.2 53.59,81.71 49.15,81.71 47.88,80.44 47.88,79.05 48.26,78.66 48.12,78.66
VCC_5V on Top Layer: 59.56,66.73 58.17,68.12 58.17,70.59 56.3,72.46 56.3,77.61 54.86,79.05 54.86,79.8 59.17,79.8 60.07,80.7 59.57,81.19 53.29,81.19 53.29,77.85 53.09,77.65 53.09,68.76 54.99,66.85 54.99,63.68 56.26,62.41 58.93,62.41 59.56,63.04
VCC_5V on Top Layer: 55.08,79.89 56.01,78.96 56.01,78.79 58.04,76.76 59.82,76.76 60.96,77.9 60.96,78.92 60.2,79.68 60.07,79.68 60.07,80.7 59.82,80.95 55.25,80.95 55.12,81.08 55.08,81.04
VCC_5V on Bottom Layer: 58.77,76.53 60.34,76.53 73.66,89.84 73.66,96.57 74.04,96.95 73.79,97.21 71.88,97.21 69.72,90.09 64.9,85.9 59.06,80.06 56.45,80.06 55.51,79.12 58.25,76.38 58.67,76.38 58.77,76.48
VCC_5V on Bottom Layer: 52.87,88.06 67.82,88.06 67.82,84.89 52.87,84.89
VCC_12V on Top Layer: 94.34,79.28 95.39,78.22 95.39,3.14 94.4,2.15 90.34,2.15 90.34,62.79 84.37,68.76 83.82,68.76
VCC_12V on Top Layer: 83.31,73.97 86.36,77.01 86.36,89.98 90.34,93.96 90.34,97.79 93.84,97.79 96.5,95.13 96.5,90.52 94.87,78.03 91.38,71.87 86.74,67.23 86.74,70.54
VCC_12V on Top Layer: 81.16,72.19 83.19,74.22 85.09,74.22 87,72.31 87,69.39 85.6,68 81.79,68 80.01,69.77 80.01,70.16 65.41,70.16 64.64,70.92 64.64,72.44 64.9,72.69 78.49,72.69 78.87,72.31 81.03,72.31
$2N2089 on Top Layer: 62.23,72.98 62.45,73.2 63.28,73.2 63.5,72.98 63.5,67.79 64.18,67.11 64.77,67.11 64.77,63.42 64.13,62.79 61.59,62.79 60.96,63.42 60.96,68.38 61.85,69.27 61.85,70.41 62.23,70.79

Small or netless copper shapes (teardrops, artwork), in the pictures only: 1 on Top Layer

## Text on the board
Top Silkscreen Layer: GPIO29 | PC0 | PC1 | PC2 | PC3 | PA1 | 5V | GND | PC9 | PD2 | PA4 | PA0 | GPIO5 | GPIO6 | GPIO1 | GPIO4 | RST | DC | SCK | DIN | VCC | CS | TX | RX | TX&RX | PB7_P | PC12 | PB5 | PB3 | PB4 | PC15 | PA7 | PC4 | PC14 | PC13 | PC5 | PB0 | PA5 | PB1 | PA6 | 9855_LED | PB9_P | PA9 | PA8 | PC8 | PA15 | PB12 | PA12 | 12V_LED | RX3 | TX3 | PA10 | PA11 | NC | RESET | PC6 | PB15 | PB14 | PB13 | PC7 | SWCLK | SWDIO | 3.3V | 12V | designed by YYJ | 按钮输入 | 树莓派上电跳帽 | 降压芯片开关
